# EAGLE design mountingBoard (EAGLE 7.6.0)
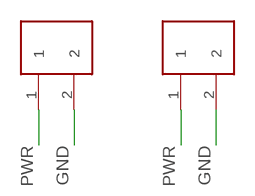
[diagram p0: schematic, sheet 1]

## Parts
U$1  TERMINALBLOCK277-1667-ND  [TERMINALBLOCK277-1667-ND]
U$2  TERMINALBLOCK277-1667-ND  [TERMINALBLOCK277-1667-ND]

## Nets
GND: U$1.2 U$2.2
PWR: U$1.1 U$2.1

## Library data of the parts
U$1 U$2 = makesmith:TERMINALBLOCK277-1667-ND

## Board
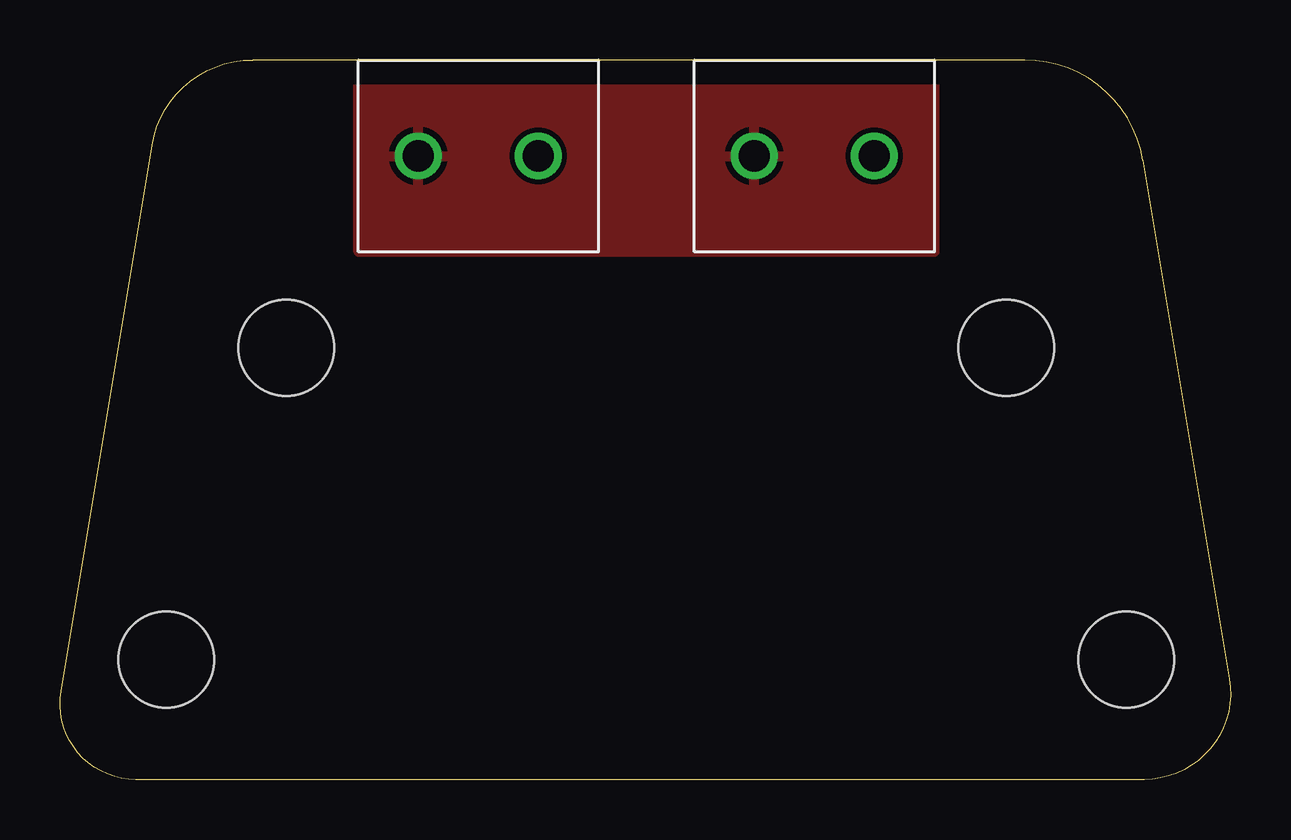
[diagram p1: board, top side]
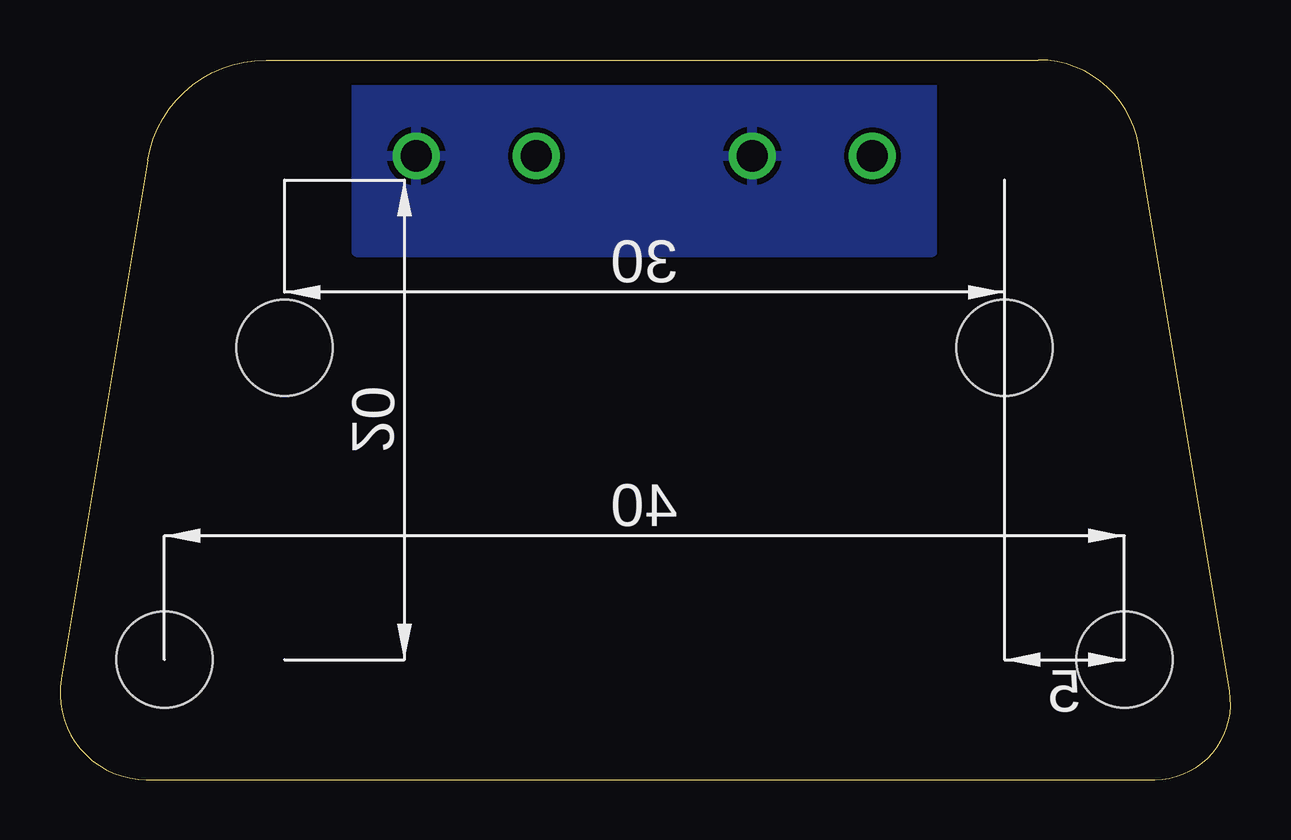
[diagram p2: board, bottom side, seen from below]

Size 48.78 x 30 mm. Coordinates in mm from the lower left corner, seen from the top.
Outline: 45.17,0 3.16,0 arc-99 0.04,3.68 3.84,26.45 arc-81 8.02,30 40.19,30 arc-81 45.12,25.82 48.73,4.2 arc-99 45.17,0
Copper layers (1*16): Top 0.035mm / dielectric 1.5mm / Bottom 0.035mm
Design rules "default": minimum track width 10mil, minimum drill 24mil, track to track 8mil, track to pad 8mil, pad to pad 8mil, via to via 8mil, smd to smd 8mil, copper to edge 40mil, drill to drill 8mil, minimum pad ring 10mil, minimum via ring 8mil, stop-mask expansion 4mil, vias tented up to drill 0mil, thermal gap 10mil
Holes 4 mm at 4.43,5 44.43,5 9.43,18 39.43,18

### Footprints (pad centres in the part's own frame; a part is rotated, then mirrored left to right if it is on the bottom)
TERMINALBLOCK277-1667-ND = drill 1.3: 1 -2.5,0; 2 2.5,0

### Placement (x,y rotation side)
U$1  17.43,26 0 top
U$2  31.43,26 0 top

### Tracks (layer width: path | path; a pad name or v marks a point on that pad's centre or on a via)
GND
  pour Bottom: 12.43,22 12.43,30 36.43,30 36.43,22
PWR
  pour Top: 12.43,22 12.43,30 36.43,30 36.43,22